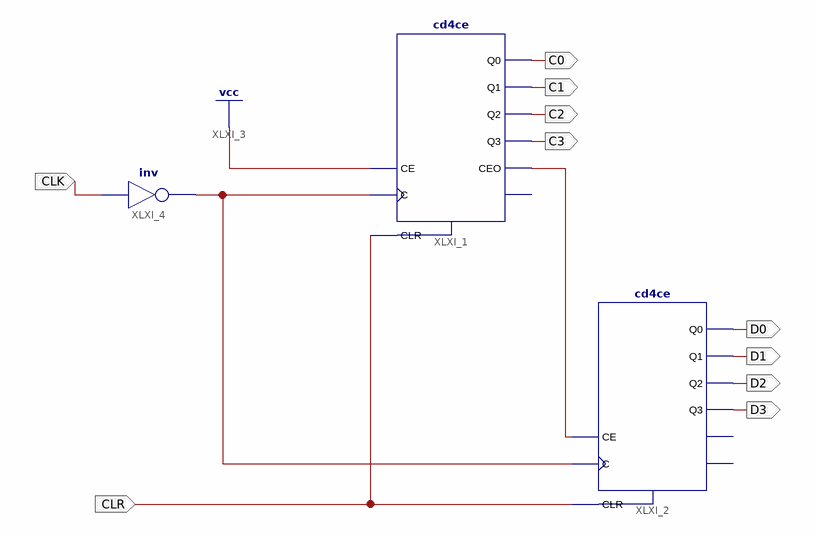
[diagram p0: schematic sheet 1]
// Xilinx ISE schematic MIN_COUNTER.sch (spartan6) as structural Verilog: 3 symbols, 10 ports
module MIN_COUNTER (
  input  CLR,
  input  CLK,
  output C0,
  output C1,
  output C2,
  output C3,
  output D0,
  output D1,
  output D2,
  output D3
);

  wire XLXN_17, XLXN_23;

  cd4ce XLXI_1 (.C(XLXN_23), .CE(1'b1), .CLR(CLR), .CEO(XLXN_17), .Q0(C0), .Q1(C1), .Q2(C2), .Q3(C3));  // open: TC
  cd4ce XLXI_2 (.C(XLXN_23), .CE(XLXN_17), .CLR(CLR), .Q0(D0), .Q1(D1), .Q2(D2), .Q3(D3));  // open: CEO, TC
  not XLXI_4 (XLXN_23, CLK);
endmodule
